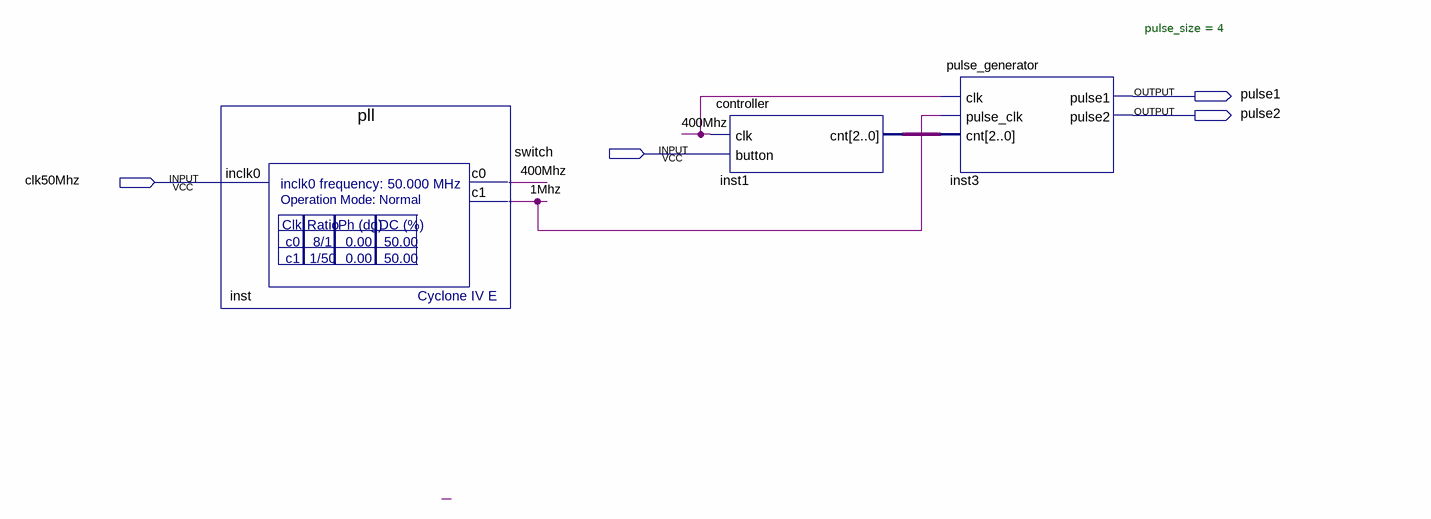
[diagram p0: schematic sheet]
// Quartus schematic pulse_gen.bdf as structural Verilog: 3 symbols, 4 pins
module pulse_gen (
  input  switch,
  input  clk50Mhz,
  output pulse1,
  output pulse2
);

  wire \1Mhz , \400Mhz ;
  wire [2:0] inst1_cnt;

  pll inst (.inclk0(clk50Mhz), .c0(\400Mhz ), .c1(\1Mhz ));
  controller inst1 (.clk(\400Mhz ), .button(switch), .cnt(inst1_cnt));
  pulse_generator #(.pulse_size(4)) inst3 (
    .clk(\400Mhz ), .pulse_clk(\1Mhz ), .cnt(inst1_cnt), .pulse1(pulse1), .pulse2(pulse2));
endmodule
